# Altium schematic sheet Power.SchDoc
size A
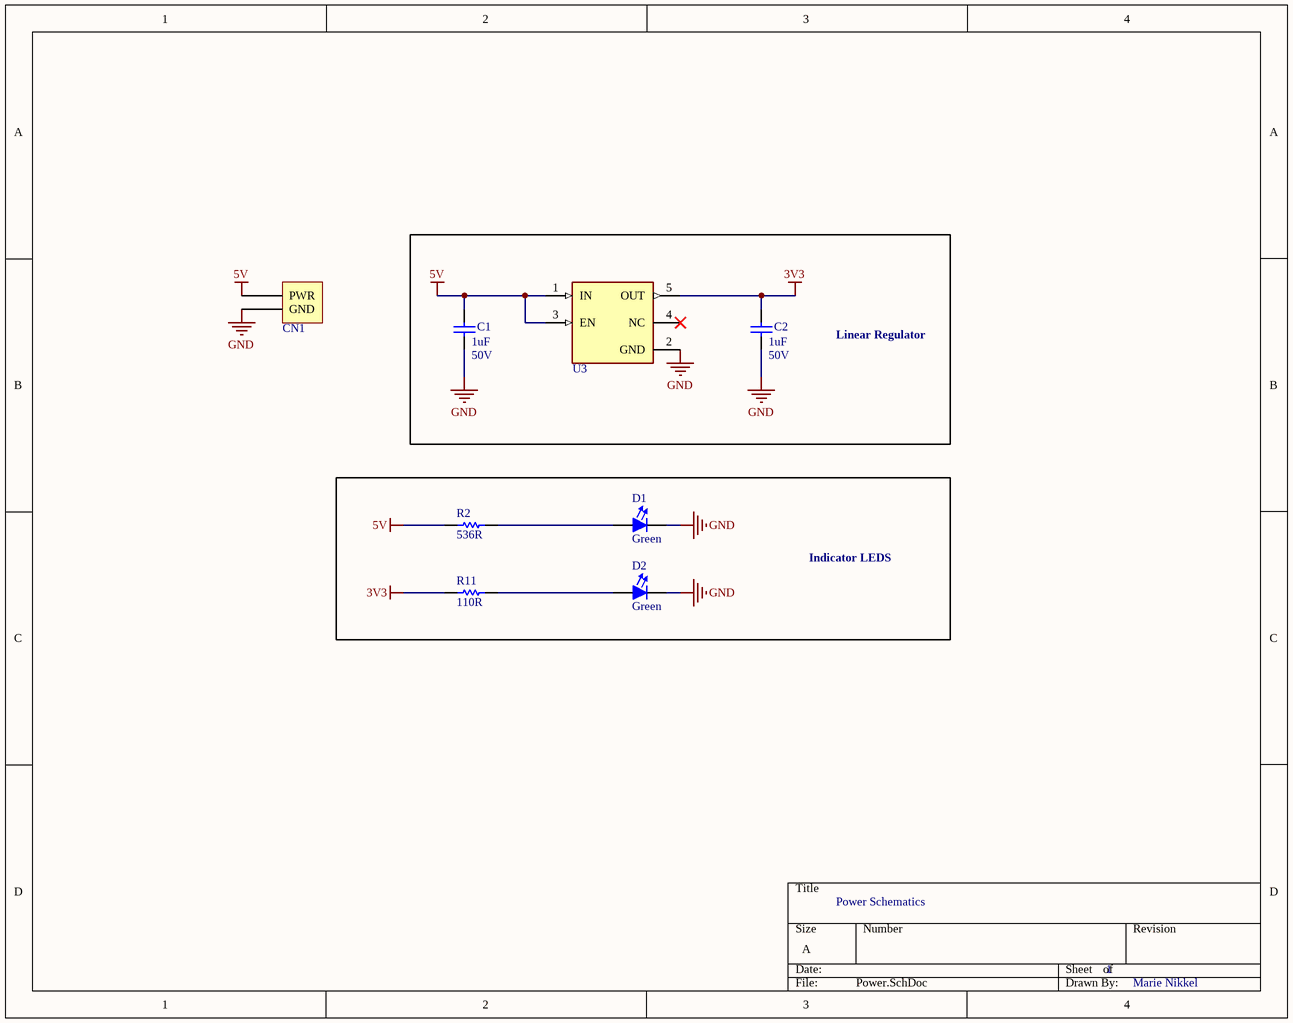
[diagram p0: Power.SchDoc]

## Parts
C1  Capacitance: 1uF  Voltage: 50V  [0803 CAP]  (hidden comment: CL21B105KBFNNNG)
C2  Capacitance: 1uF  Voltage: 50V  [0803 CAP]  (hidden comment: CL21B105KBFNNNG)
CN1  Header, Female, 1x2, Right Angle, Pitch 0.118" (3.00mm), THT  [New footprint 1]  (value not drawn)
D1  Color: Green  [FP-LB_Q39E-MFG]  (hidden comment: LT Q39G-Q1OO-25-1)
D2  Color: Green  [FP-LB_Q39E-MFG]  (hidden comment: LT Q39G-Q1OO-25-1)
R2  Resistance: 536R  [RESC1608X55X30NL15T15]  (hidden comment: ERJ-3EKF5360V)
R11  Resistance: 110R  [RESC1608X55X25ML10T15]  (hidden comment: RC0603FR-07110RL)
U3  TLV75533PDBVR  [FP-DBV0005A-IPC_B]  (value not drawn)

## Blocks framed on the sheet
Linear Regulator: C1 C2 U3
Indicator LEDS: D1 D2 R2 R11

## Nets
3V3: C2.1 R11.1 U3.5(OUT)
5V: C1.1 CN1.2(PWR) R2.1 U3.1(IN) U3.3(EN)
GND: C1.2 C2.2 CN1.1(GND) D1.1(Cathode) D2.1(Cathode) U3.2(GND)
NetD1_2: D1.2(Anode) R2.2
NetD2_2: D2.2(Anode) R11.2

Not connected (* = marked no-connect by the designer): U3 4(NC)*

## Notes on the sheet
- Power Schematics
- 1
- Marie Nikkel

## Library data of the parts
C1 C2 = CMP-00005-3: SAMSUNG ELECTRO-MECHANICS - CL21B105KBFNNNG - MLCC CAPACITORS; Tolerance: 10%; Material: Ceramic; Dielectric: X7R; Case/Package: 0805; Voltage Rating: 50V; Contact Plating: Tin; Max Operating Temperature: 125°C; Termination: Wraparound; Package Quantity: 3000; Depth: 1.25mm; Mount: Surface Mount; Min Operating Temperature: -55°C; Thickness: 0.053inch; Packaging: Tape and Reel; Case Code (Metric): 2012; Length: 2mm; Case Code (Imperial): 0805; Width: 0.049inch
CN1 = CMP-00001-4: Connector Header Through Hole, Right Angle 2 position; Gender: Male; Max Voltage Rating (DC): 250.25kV; Number of Contacts: 2; Current Rating: 5A; Glow Wire Compliant: Compliant; Voltage Rating: 600V; Voltage Rating (DC): 250V; Insulation Resistance: 1GR; Pitch: 3mm; Contact Resistance: 10mR; Length: 7.15mm; Contact Material: Brass; Housing Color: Black; Contact Plating: Gold; Packaging: Tray; Mount: Through Hole; Diameter: 3mm; Housing Material: Thermoplastic; Case/Package: SMC; Depth: 12.2mm; Termination: Solder; Color: Black; Max Current Rating: 5A; Number of Positions: 2; Lead Free: Contains Lead; Min Operating Temperature: -40°C; Number of Rows: 2; Height: 8.77mm; Package Quantity: 3168; Number of Circuits: 2; Max Operating Temperature: 105°C; Radiation Hardening: No; Flammability Rating: UL94 V-0; Orientation: Right Angle; Halogen Free: Low Halogen
D1 D2 = CMP-00064-3: LED GREEN DIFFUSED 0603 SMD; Dominant Wavelength: 530nm; Luminous Intensity: 280mcd; Lens Style: Diffused,Colorless,Rectangular; Number of LEDs: 1; Forward Voltage: 2.85V; Test Current: 5mA; Reverse Voltage: 5V; Forward Current: 15mA; Luminous Flux: 0.55lm; Radiation Hardening: No; Packaging: Tape and Reel; Mount: Surface Mount; Max Operating Temperature: 85°C; Number of Elements: 1; Number of Pins: 2; Min Operating Temperature: -40°C; Depth: 0.9mm; Case/Package: SMD/SMT; Length: 1.7mm
R2 = CMP-00071-1: SMD Chip Resistor, 0603 [1608 Metric], 536 ohm, ERJ3EK Series, 75 V, Thick Film, 100 mW; Tolerance: 1%; Voltage Rating (DC): 50V; Voltage Rating: 75V; Power Rating: 100mW; Temperature Coefficient: 100ppm/°C; Max Operating Temperature: 155°C; Package Quantity: 1; REACH SVHC: No SVHC; Depth: 0.8mm; Composition: Thick Film; Height: 0.022inch; Packaging: Tape and Reel; Contact Plating: Tin; Lead Free: Lead Free; Length: 1.6mm; Case/Package: 0603; Military Standard: Not; Features: Automotive AEC-Q200; Termination: SMD/SMT; Max Power Dissipation: 100mW; Width: 0.8mm; Mount: Surface Mount; Case Code (Metric): 1608; Case Code (Imperial): 0603; Number of Terminations: 2; Min Operating Temperature: -55°C
R11 = CMP-00069-1: RES SMD 110 OHM 1% 1/10W 0603; Max Power Dissipation: 100mW; Voltage Rating (DC): 50V; Temperature Coefficient: 100ppm/°C; Working Voltage: 75V; Military Standard: Not; Termination: SMD/SMT; Number of Terminations: 2; Features: Moisture Resistant; Min Operating Temperature: -55°C; Power Rating: 100mW; Height: 0.022inch; Package Quantity: 1; Lead Free: Lead Free; Tolerance: 1%; Voltage Rating: 50V; Composition: Thick Film; Case Code (Imperial): 0603; Length: 1.6mm; Packaging: Tape and Reel; Case Code (Metric): 1608; Max Operating Temperature: 155°C; Depth: 0.8mm; Case/Package: 0603; Width: 0.031inch
U3 = CMP-044-0002-1: 500-mA, high-PSRR, low-IQ, low-dropout voltage regulator with enable 5-SOT-23 -40 to 125; Max Input Voltage: 5.5V; Quiescent Current: 31uA; Output Current: 500mA; Dropout Voltage: 238mV; Output Configuration: Positive; Output Type: Fixed; Number of Regulators: 1; Min Output Voltage: 3.3V; Power Supply Rejection Ratio (PSRR): 52dB; Max Operating Temperature: 125°C; Mount: Surface Mount; Max Output Voltage: 3.3V; Packaging: Cut Tape; Case/Package: SOT-23-5; Min Operating Temperature: -40°C